# EAGLE design firefly (EAGLE 5.11)
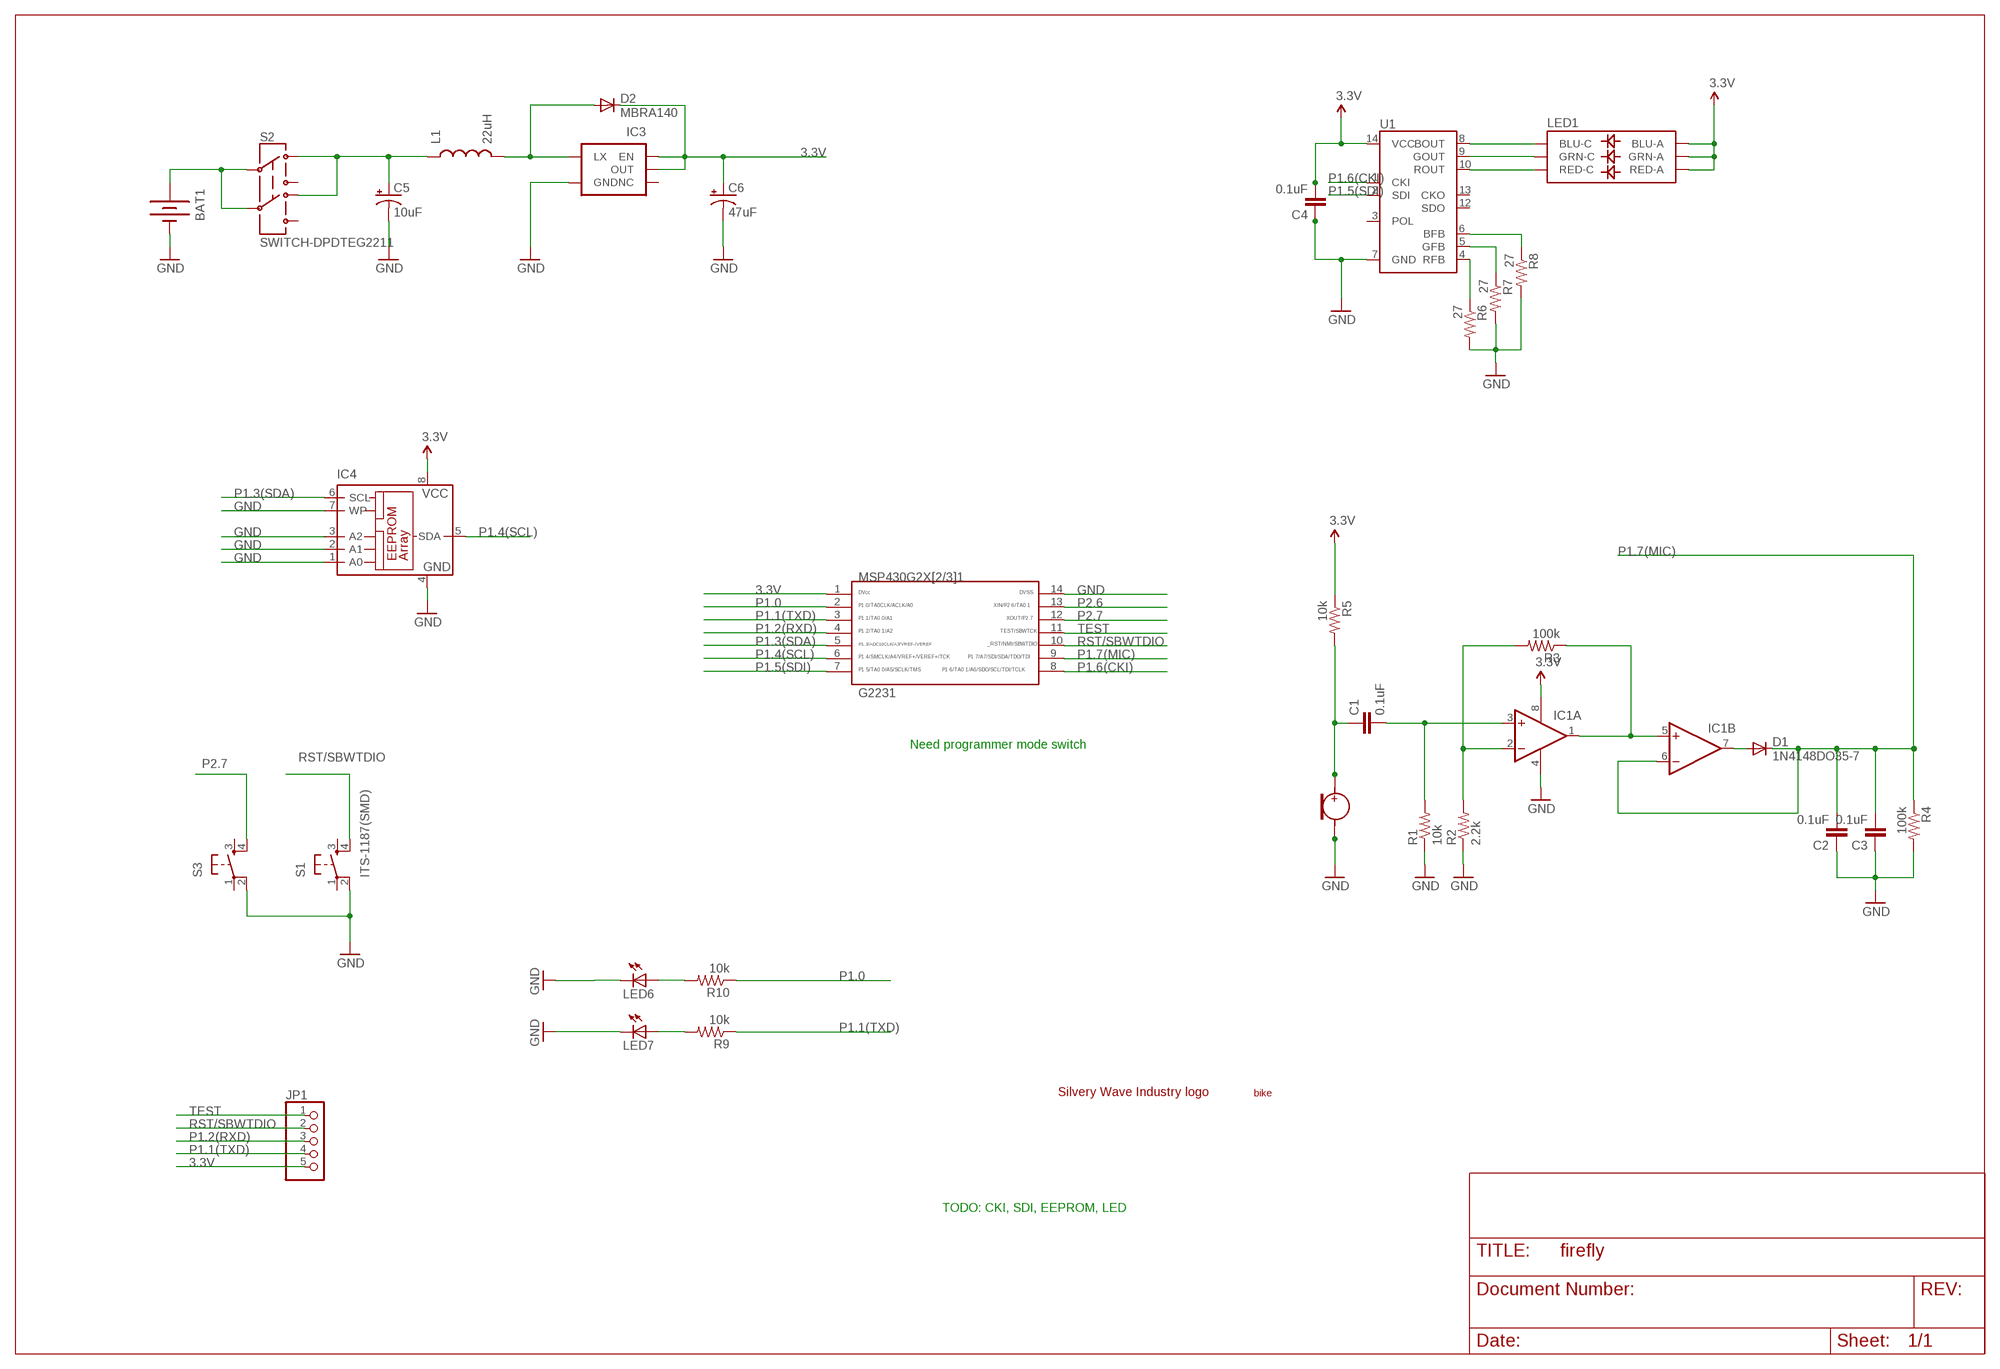
[diagram p0: schematic, sheet 1]

## Parts
BAT1  BATTERYAA  [BATTERY-AA]
C1  0.1uF  C-EUC2012  [C2012]
C2  0.1uF  C-EUC2012  [C2012]
C3  0.1uF  C-EUC2012  [C2012]
C4  0.1uF  C-EUC2012  [C2012]
C5  10uF  CAP_POL1206  [EIA3216]
C6  47uF  CAP_POL3528  [EIA3528]
D1  1N4148DO35-7  DIODESMA  [SMA-DIODE]
D2  MBRA140  DIODESMA  [SMA-DIODE]
G2231  G2X[2/3]1---PW14  [PW14]
IC1  LM358D  [SO08]
IC3  V_REG_NCP1400SOT23-5  [SOT23-5]
IC4  24LC256P  [DIL8]
JP1  PINHD-1X5  [1X05]
L1  22uH  INDUCTORCR54  [CR54]
LED1  LED-TRICOLOR-5050  [LED-TRICOLOR-5050]
LED6  LED1206  [LED-1206]
LED7  LED1206  [LED-1206]
R1  10k  R-US_M2012  [M2012]
R2  2.2k  R-US_M2012  [M2012]
R3  100k  R-US_M2012  [M2012]
R4  100k  R-US_M2012  [M2012]
R5  10k  R-US_M2012  [M2012]
R6  27  R-US_M2012  [M2012]
R7  27  R-US_M2012  [M2012]
R8  27  R-US_M2012  [M2012]
R9  10k  R-US_M2012  [M2012]
R10  10k  R-US_M2012  [M2012]
S1  ITS-1187(SMD)  TAC_SWITCHPTH  [TACTILE-PTH]
S2  SWITCH-DPDTEG2211  [EG2211]
S3  TAC_SWITCHPTH  [TACTILE-PTH]
U1  WS2801  [SOP-14]
U2  MIC  [MIC9.7MM]
U$1  SILVERYWAVE  [SILVERYWAVE]
U$2  BIKE  [BIKE]

## Nets
3.3V [3.3]: C4.2 C6.A(+) D2.C G2231.1 IC1.8(P:V+) IC3.1(EN) IC3.2(OUT) IC4.8(VCC) JP1.5 LED1.1(GRN-A) LED1.2(RED-A) LED1.3(BLU-A) R5.1 U1.14(VCC)
GND [Ground]: BAT1.GND@1(-) C2.1 C3.1 C4.1 C5.C(-) C6.C(-) G2231.14 IC1.4(P:V-) IC3.4(GND) IC4.1(A0) IC4.2(A1) IC4.3(A2) IC4.4(GND) IC4.7(WP) LED6.C LED7.C R1.1 R2.1 R4.2 R6.2 R7.2 R8.2 S1.2 S3.2 U1.7(GND) U2.GND(-)
N$1: C1.2 IC1.3(A:+IN) R1.2
N$2: IC1.2(A:-IN) R2.2 R3.2
N$3: LED1.4(BLU-C) U1.8(BOUT)
N$4: IC1.1(A:OUT) IC1.5(B:+IN) R3.1
N$5: D1.A IC1.7(B:OUT)
N$6: LED1.6(GRN-C) U1.9(GOUT)
N$7: LED1.5(RED-C) U1.10(ROUT)
N$8: R6.1 U1.4(RFB)
N$10: C1.1 R5.2 U2.PLUS(+)
N$11: R7.1 U1.5(GFB)
N$12: R8.1 U1.6(BFB)
N$13: D2.A IC3.5(LX) L1.P$2
N$14: LED7.A R9.2
N$16 [3.3]: BAT1.PWR@1(+) S2.P1 S2.P2
N$17: C5.A(+) L1.P$1 S2.P1-TA S2.P2-TA
N$34: LED6.A R10.2
P1.0: G2231.2 R10.1
P1.1(TXD): G2231.3 JP1.4 R9.1
P1.2(RXD): G2231.4 JP1.3
P1.3(SDA): G2231.5 IC4.6(SCL)
P1.4(SCL): G2231.6 IC4.5(SDA)
P1.5(SDI): G2231.7 U1.2(SDI)
P1.6(CKI): G2231.8 U1.1(CKI)
P1.7(MIC): C2.2 C3.2 D1.C G2231.9 IC1.6(B:-IN) R4.1
P2.6: G2231.13
P2.7: G2231.12 S3.4
RST/SBWTDIO: G2231.10 JP1.2 S1.4
TEST: G2231.11 JP1.1
Unconnected: IC3.3(NC) S1.1 S1.3 S2.P1-TB S2.P2-TB S3.1 S3.3 U1.3(POL) U1.12(SDO) U1.13(CKO)

## Notes on the sheet
- Need programmer mode switch
- TODO: CKI, SDI, EEPROM, LED

## Library data of the parts
BAT1 = SparkFun:BATTERY: Battery Holders Various common sizes : AA, AAA, 20mm coin cell and 12mm coin cell.
C1-C4 = resistor:C-EU: CAPACITOR, European symbol
C5 C6 = SparkFun:CAP_POL: Capacitor Polarized These are standard SMD and PTH capacitors. Normally 10uF, 47uF, and 100uF in electrolytic and tantalum varieties. Always verify the external diameter of the through hole cap, it varies with capacity, voltage, and manufacturer. The EIA devices should be standard.
D1 D2 = SparkFun:DIODE: Diode These are standard reverse protection diodes and small signal diodes. SMA package can handle up to about 1A. SOD-323 can handle about 200mA. What the SOD-323 package when ordering, there are some mfgs out there that are 5-pin packages.
G2231 = TI_MSP430_v16:G2X[2/3]1---PW14: MSP430G2X[2/3]1 TSSOP (PW) 14 Pin Package http://focus.ti.com/docs/prod/folders/print/msp430g2221.html MSP430G2121, MSP430G2221, MSP430G2131
IC1 = linear:LM358: OP AMP also LM158; LM258; LM2904 Source: http://cache.national.com/ds/LM/LM158.pdf
IC3 = SparkFun:V_REG_NCP1400: Switching step-up voltage regulator NCP1400 switiching regulator takes single cell AA and outputs 100mA at 3.3V or 5V with minimal number of external components.
IC4 = microchip:24*: Serial EEPROM I2C; MF: MICROCHIP; MPN: 24LC256-E/P; OC_FARNELL: 9757970; OC_NEWARK: 92C7169
JP1 = pinhead:PINHD-1X5: PIN HEADER
L1 = SparkFun:INDUCTOR: Inductors Basic Inductor/Choke - 0603 and 1206. Footprints are not proven and vary greatly between part numbers.
LED1 = SparkFun:LED-TRICOLOR-5050
LED6 LED7 = SparkFun:LED: LEDs Standard schematic elements and footprints for 5mm, 3mm, 1206, and 0603 sized LEDs. 5mm - Spark Fun Electronics SKU : COM-00529 (and others)
R1-R10 = resistor:R-US_: RESISTOR, American symbol
S1 S3 = SparkFun:TAC_SWITCH: Momentary Switch Button commonly used for reset or general input. Spark Fun Electronics SKU : COM-00097
S2 = SparkFun:SWITCH-DPDT: DPDT Version of the COM-00597
U1 = SparkFun:WS2801: WS2801 3 Channel Constant Current LED Driver with programmable PWM outputs. Datasheet: http://www.sparkfun.com/datasheets/Components/LED/WS2801.pdf
U2 = fetm:MIC
U$1 = silverywaveindustry:SILVERYWAVE
U$2 = donghee:BIKE

## Net classes
0 default: width 0.254 mm
1 Ground: width 0.5 mm, drill 0.2 mm
2 3.3: width 0.5 mm, drill 0.2 mm

## Board
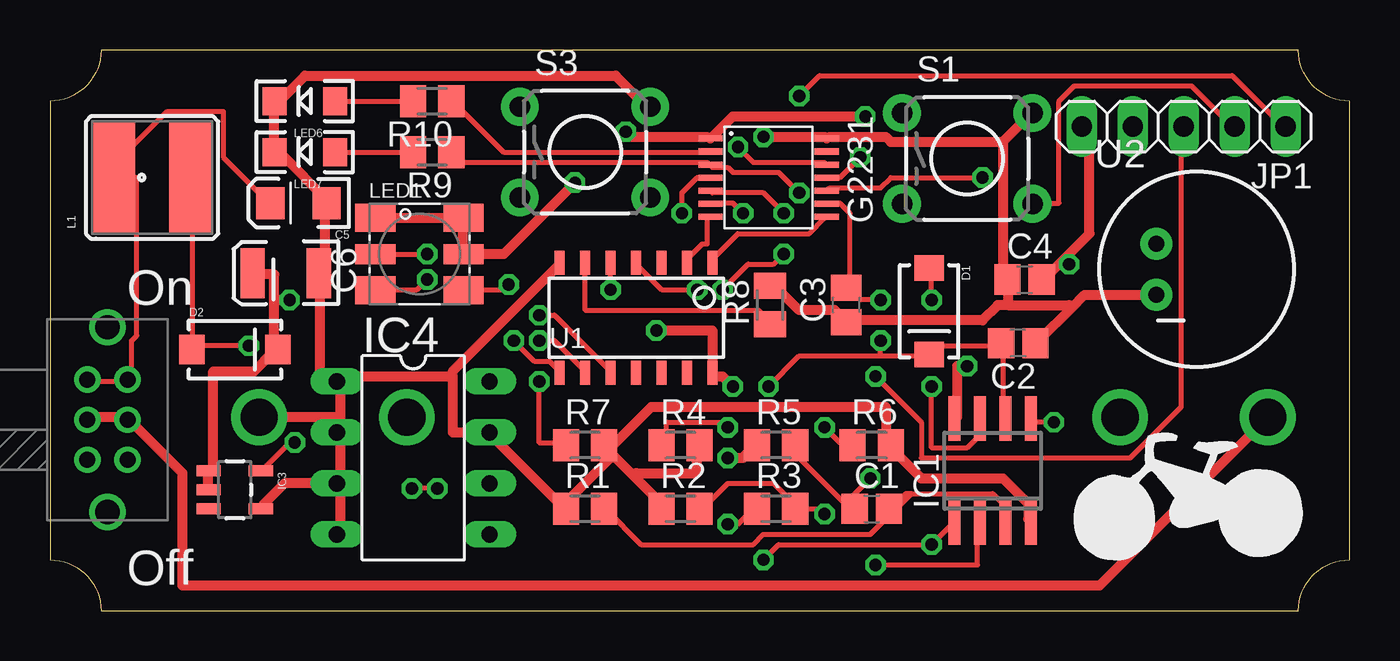
[diagram p1: board, top side]
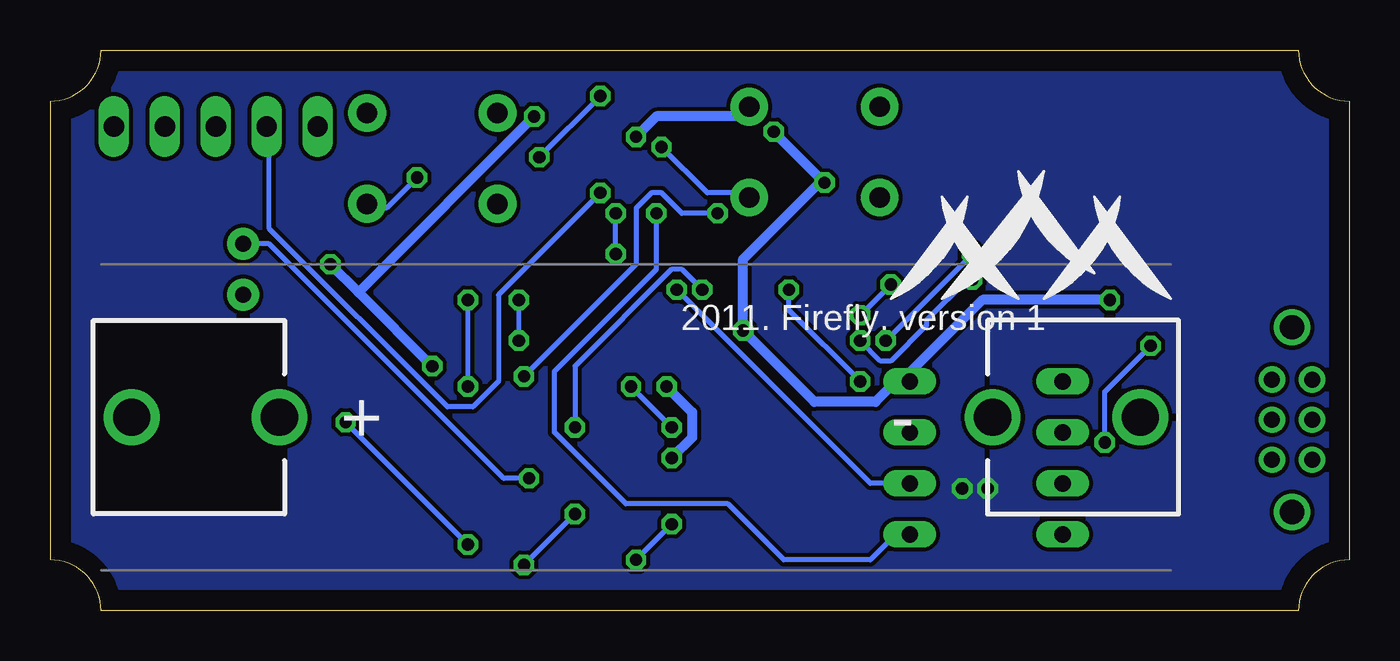
[diagram p2: board, bottom side, seen from below]

Size 64.77 x 27.94 mm. Coordinates in mm from the lower left corner, seen from the top.
Outline: 62.23,27.94 2.54,27.94 arc-90 0,25.4 0,2.54 arc-90 2.54,0 62.23,0 arc-90 64.77,2.54 64.77,25.4 arc-90 62.23,27.94
Copper layers (1*16): Top 0.035mm / dielectric 1.5mm / Bottom 0.035mm
Design rules "default": minimum track width 10mil, minimum drill 24mil, track to track 8mil, track to pad 8mil, pad to pad 8mil, via to via 8mil, smd to smd 8mil, copper to edge 40mil, drill to drill 8mil, minimum pad ring 10mil, minimum via ring 8mil, stop-mask expansion 4mil, vias tented up to drill 0mil, thermal gap 10mil

### Footprints (pad centres in the part's own frame; a part is rotated, then mirrored left to right if it is on the bottom)
BATTERY-AA = drill 1.854 round: GND@1 25.146,0; GND@2 17.78,0; PWR@1 -25.146,0; PWR@2 -17.78,0
C2012 = smd 1.3 x 1.5: 1 -0.85,0; 2 0.85,0
EIA3216 = smd 1.4 x 1.6: A 1.4,0; C -1.4,0
EIA3528 = smd 1.2 x 2.5: A 1.65,0; C -1.65,0
SMA-DIODE = smd 1.27 x 1.47: A -2.15,0; C 2.15,0
PW14 = smd 0.3 x 1.2: 1 -1.95,-2.9; 2 -1.3,-2.9; 3 -0.65,-2.9; 4 0,-2.9; 5 0.65,-2.9; 6 1.3,-2.9; 7 1.95,-2.9; 8 1.95,2.9; 9 1.3,2.9; 10 0.65,2.9; 11 0,2.9; 12 -0.65,2.9; 13 -1.3,2.9; 14 -1.95,2.9
SO08 = smd 0.6 x 2.2: 1 -1.905,-2.6; 2 -0.635,-2.6; 3 0.635,-2.6; 4 1.905,-2.6; 5 1.905,2.6; 6 0.635,2.6; 7 -0.635,2.6; 8 -1.905,2.6
SOT23-5 = smd 0.55 x 1.2: 1 -0.95,-1.3; 2 0,-1.3; 3 0.95,-1.3; 4 0.95,1.3; 5 -0.95,1.3
DIL8 = drill 0.813 long: 1 -3.81,-3.81; 2 -1.27,-3.81; 3 1.27,-3.81; 4 3.81,-3.81; 5 3.81,3.81; 6 1.27,3.81; 7 -1.27,3.81; 8 -3.81,3.81
1X05 = drill 1.016 long: 1 -5.08,0; 2 -2.54,0; 3 0,0; 4 2.54,0; 5 5.08,0
CR54 = smd 5.5 x 2.15: P$1 0,1.92; P$2 0,-1.92
LED-TRICOLOR-5050 = smd 2 x 1.4: 1 2.2,1.8; 2 -2.2,1.8; 5 2.2,-1.8; 6 -2.2,-1.8 | smd 2 x 1: 3 2.2,0; 4 -2.2,0
LED-1206 = smd 1.2 x 1.4: A -1.5,0; C 1.5,0
M2012 = smd 1.3 x 1.6: 1 -0.95,0; 2 0.95,0
TACTILE-PTH = drill 1.016 pad 1.88 round: 1 -3.251,2.261; 2 3.251,2.261; 3 -3.251,-2.261; 4 3.251,-2.261
EG2211 = drill 0.8 round: P1 -1,0; P1-TA -1,2; P1-TB -1,-2; P2 1,0; P2-TA 1,2; P2-TB 1,-2 | drill 1.2 round: P$7 0,4.6; P$8 0,-4.6
SOP-14 = smd 0.5 x 1.2: 1 -3.81,-2.75; 2 -2.54,-2.75; 3 -1.27,-2.75; 4 0,-2.75; 5 1.27,-2.75; 6 2.54,-2.75; 7 3.81,-2.75; 8 3.81,2.75; 9 2.54,2.75; 10 1.27,2.75; 11 0,2.75; 12 -1.27,2.75; 13 -2.54,2.75; 14 -3.81,2.75
MIC9.7MM = drill 0.8 pad 1.6 round: GND -2,-1.27; PLUS -2,1.27

### Placement (x,y rotation side)
BAT1  35.56,9.65 0 bottom
C1  40.96,5.08 0 top
C2  48.26,13.34 180 top
C3  39.69,15.24 90 top
C4  48.58,16.51 0 top
C5  12.38,20.32 180 top
C6  11.75,16.83 180 top
D1  43.81,14.92 270 top
D2  9.21,13.02 0 top
G2231  35.81,21.59 270 top
IC1  46.99,6.99 0 top
IC3  9.21,6.03 270 top
IC4  18.1,7.62 270 top
JP1  56.52,24.13 180 top
L1  5.08,21.59 90 top
LED1  18.41,17.78 0 top
LED6  12.7,25.4 180 top
LED7  12.7,22.86 180 top
R1  26.67,5.08 0 top
R2  31.43,5.08 0 top
R3  36.2,5.08 0 top
R4  31.43,8.26 0 top
R5  36.2,8.26 0 top
R6  40.96,8.26 0 top
R7  26.67,8.26 0 top
R8  35.88,15.24 90 top
R9  19.05,22.86 180 top
R10  19.05,25.4 180 top
S1  45.72,22.54 0 top
S2  2.86,9.53 0 top
S3  26.67,22.86 0 top
U1  29.21,14.61 180 top
U2  57.15,17.02 0 top
U$1  16.51,18.1 0 bottom
U$2  51.05,2.54 0 top

### Tracks (layer width: path | path; a pad name or v marks a point on that pad's centre or on a via)
3.3V  (via drill 0.61)
  Top 0.5: 50.42,17.4 51.82,18.8 51.82,24.13 JP1.5 | 50.42,17.4 49.53,16.51 C4.2 | v45.72,12.19 45.21,12.19 45.21,9.65 IC1.8 | v50.8,17.27 50.55,17.27 50.42,17.4 | IC3.2 7.87,6.1 7.87,6.86 IC3.1 8.13,7.11 8.13,11.94 10.16,11.94 11.18,12.95 D2.C 11.18,13.21 11.18,15.49 | 11.18,15.49 11.18,16.76 10.16,16.76 C6.A | LED1.2 16.26,19.56 20.57,19.56 LED1.1 20.57,19.3 20.57,17.78 LED1.3 22.61,17.78 v26.16,21.34 | v28.7,23.88 28.96,23.62 32.77,23.62 G2231.1 33.02,23.62 34.04,24.64 v40.64,24.64 | v30.23,13.97 33.02,13.97 U1.14 33.02,11.68 33.53,11.68 v34.04,11.18 | v33.78,7.62 34.54,7.62 35.05,8.13 R5.1 | 11.18,15.49 v11.94,15.49
  Bottom 0.5: 49.4,15.88 v50.8,17.27 | 49.4,15.88 v45.72,12.19 | v28.7,23.88 v26.16,21.34 26.42,21.34 30.23,17.53 v30.23,13.97 26.67,10.41 23.62,10.41 22.61,11.43 22.35,11.43 | v33.78,7.62 32.77,8.64 32.77,9.91 v34.04,11.18 | 22.35,11.43 IC4.8 22.1,11.43 | v11.94,15.49 18.29,15.49 22.35,11.43 | v40.64,24.64 49.4,15.88
GND  (via drill 0.61)
  Top 0.5: 47.5,23.37 41.91,23.37 41.66,23.62 38.86,23.62 G2231.14 38.61,23.62 v35.56,23.62 | 47.5,23.37 48.77,24.64 S1.2 | R8.2 36.07,16 36.32,16 37.34,14.99 39.12,14.99 39.62,14.48 C3.1 39.88,14.48 46.48,14.48 47.24,15.24 47.75,15.24 | 50.93,15.11 51.56,15.75 U2.GND | 50.93,15.11 49.28,13.46 C2.1 | 47.75,15.24 47.75,16.51 C4.1 47.5,16.51 47.5,23.37 | 47.75,15.24 50.8,15.24 50.93,15.11 | S3.2 29.72,25.15 28.19,26.67 12.7,26.67 11.43,25.4 LED6.C 11.18,25.4 11.18,22.86 LED7.C 11.43,22.86 13.97,20.32 C5.C 13.72,20.32 13.72,17.02 13.46,17.02 C6.C 13.46,16.76 13.46,11.68 14.48,11.68 IC4.1 14.48,11.43 | 14.48,9.65 14.48,11.43 | 14.48,8.89 14.48,9.65 | IC3.4 10.67,5.33 11.68,6.35 IC4.3 14.48,6.35 | 14.48,6.35 14.48,3.81 IC4.4 | 14.48,6.35 14.48,8.89 | 14.48,8.89 IC4.2 | 14.48,9.65 BAT1.GND@1 | IC1.4 48.77,4.57 48.77,5.33 47.5,6.6 43.43,6.6 41.91,8.13 R6.2 41.66,8.38 41.66,10.16 29.97,10.16 27.94,8.13 R7.2 | 29.08,6.73 30.73,5.08 R2.1 | 29.08,6.73 27.69,8.13 R7.2 | R4.2 32.26,8.13 32.26,6.86 29.21,6.86 29.08,6.73 | 20.07,11.68 20.07,8.89 21.84,8.89 | 20.07,11.68 20.07,11.94 25.4,17.27 U1.7 | 21.84,8.89 25.65,5.08 R1.1 25.65,5.33 27.94,7.62 R7.2 | 21.84,8.89 IC4.7 | 14.48,11.43 14.73,11.68 20.07,11.68
  Bottom 0.5: v35.56,23.62 34.54,24.64 30.23,24.64 29.97,24.89 S3.2
N$1
  Top 0.254: 42.93,5.84 46.99,5.84 47.5,5.33 47.5,4.57 IC1.3 | 42.93,5.84 42.67,5.84 41.91,5.08 C1.2 | 42.93,5.84 40.89,3.81 35.56,3.81 35.05,3.3 29.46,3.3 27.69,5.08 R1.2
N$2  (via drill 0.61)
  Top 0.254: 37.34,5.08 36.07,6.35 33.78,6.35 32.51,5.08 R2.2 | v41.15,2.29 46.23,2.29 46.23,4.32 IC1.2 | v38.61,4.83 38.35,5.08 37.34,5.08 | 37.34,5.08 R3.2
  Bottom 0.254: v38.61,4.83 v41.15,2.29
N$3  (via drill 0.61)
  Top 0.254: v23.11,13.46 24.13,12.45 24.89,12.45 25.4,11.94 U1.8 | LED1.4 v18.8,17.78
  Bottom 0.254: v18.8,17.78 v23.11,13.46
N$4  (via drill 0.61)
  Top 0.254: v33.78,4.32 34.29,4.32 35.05,5.08 R3.1 | v35.56,2.54 36.32,3.3 v43.94,3.3 44.96,4.32 IC1.1 | v50.04,9.4 49.02,9.4 IC1.5
  Bottom 0.254: v33.78,4.32 v35.56,2.54 | v43.94,3.3 v50.04,9.4
N$5  (via drill 0.61)
  Top 0.254: v43.94,15.49 43.94,17.02 D1.A | v43.94,11.18 43.94,8.13 45.72,8.13 46.23,8.64 46.23,9.4 IC1.7
  Bottom 0.254: v43.94,11.18 v43.94,15.49
N$6  (via drill 0.61)
  Top 0.254: v24.38,13.46 25.15,13.46 26.67,11.94 U1.9 | v18.8,16.51 18.29,16 16.26,16 LED1.6
  Bottom 0.254: v24.38,13.46 23.37,12.45 22.86,12.45 21.08,14.22 21.08,14.48 19.05,16.51 v18.8,16.51
N$7  (via drill 0.61)
  Top 0.254: v24.38,14.73 25.15,14.73 27.94,11.94 U1.10 | v22.86,16.26 22.61,16 20.83,16 LED1.5
  Bottom 0.254: v22.86,16.26 v24.38,14.73
N$8  (via drill 0.61)
  Top 0.254: v32.26,16 30.48,16 29.21,17.27 U1.4 | v38.61,9.14 39.37,8.38 39.88,8.38 R6.1
  Bottom 0.254: v32.26,16 33.27,17.02 33.78,17.02 38.61,12.19 v38.61,9.14
N$10  (via drill 0.61)
  Top 0.254: 39.62,5.33 37.34,7.62 37.34,8.13 R5.2 | 39.62,5.33 39.88,5.08 C1.1 39.62,5.33 | 39.62,5.33 v40.89,6.6
  Bottom 0.254: v40.89,6.6 42.16,6.6 53.85,18.29 U2.PLUS
N$11  (via drill 0.61)
  Top 0.254: v24.38,11.43 24.38,8.38 25.65,8.38 R7.1 | v27.94,16 U1.5
  Bottom 0.254: v27.94,16 27.94,14.99 v24.38,11.43
N$12
  Top 0.254: U1.6 26.67,14.99 35.31,14.99 35.81,14.48 R8.1
N$13  (via drill 0.61)
  Top 0.254: v12.19,8.38 11.94,8.38 10.67,7.11 IC3.5 | v9.91,13.21 7.11,13.21 | 7.11,13.21 7.11,21.59 L1.P$2 | 7.11,13.21 D2.A
  Bottom 0.254: v12.19,8.38 12.19,10.92 v9.91,13.21
N$14
  Top 0.254: LED7.A R9.2
N$15  (via drill 0.61)
  Top 0.254: v19.3,6.1 v18.03,6.1
  pour Bottom: 2.83,-0.08 0.29,2.46 0.29,25.32 2.83,27.86 61.77,27.86 64.31,25.32 64.31,2.46 61.77,-0.08
N$16
  Top 0.5: S2.P1 2.03,9.65 3.81,9.65 S2.P2 4.06,9.4 6.6,6.86 6.6,1.27 52.32,1.27 BAT1.PWR@1
N$17
  Top 0.254: S2.P1-TA 2.03,11.43 3.81,11.43 S2.P2-TA 4.06,11.68 4.06,13.46 4.32,13.72 4.32,21.59 3.3,21.59 | 3.3,21.59 3.3,22.35 5.84,24.89 8.64,24.89 8.64,22.61 10.92,20.32 C5.A | 3.3,21.59 L1.P$1
N$34
  Top 0.254: LED6.A R10.2
P1.0
  Top 0.254: G2231.2 32.77,22.86 22.61,22.86 20.07,25.4 R10.1
P1.1(TXD)  (via drill 0.61)
  Top 0.254: R9.1 20.07,22.86 20.57,22.35 32.77,22.35 G2231.3 33.02,22.1 33.78,22.1 34.04,21.84 36.32,21.84 v37.34,20.83
  Bottom 0.254: v37.34,20.83 42.42,15.75 42.42,11.43 43.69,10.16 44.96,10.16 53.85,19.05 53.85,24.13 JP1.4
P1.2(RXD)  (via drill 0.61)
  Top 0.254: v31.5,19.81 31.5,20.83 32.26,21.59 G2231.4 | v41.15,11.68 43.43,9.4 43.43,7.62 53.85,7.62 56.39,10.16 56.39,24.13 JP1.3
  Bottom 0.254: v31.5,19.81 33.27,19.81 34.29,20.83 34.8,20.83 35.56,20.07 35.56,17.27 v41.15,11.68
P1.3(SDA)  (via drill 0.61)
  Top 0.254: v36.58,19.81 35.56,20.83 33.02,20.83 G2231.5 | v36.58,17.78 36.07,17.27 34.8,17.27 v33.53,16
  Bottom 0.254: v36.58,17.78 v36.58,19.81 | v33.53,16 23.88,6.35 IC4.6
P1.4(SCL)  (via drill 0.61)
  Top 0.254: v34.54,19.81 34.04,20.32 33.02,20.32 G2231.6
  Bottom 0.254: v34.54,19.81 34.54,17.02 39.62,11.94 39.62,8.89 36.07,5.33 30.99,5.33 28.19,2.54 23.88,2.54 22.61,3.81 IC4.5
P1.5(SDI)
  Top 0.254: G2231.7 32.77,19.56 32.77,18.29 32.51,18.29 31.75,17.53 U1.2
P1.6(CKI)
  Top 0.254: G2231.8 38.61,19.56 37.85,18.8 34.29,18.8 33.02,17.53 U1.1
P1.7(MIC)  (via drill 0.61)
  Top 0.254: G2231.9 38.86,20.32 39.37,20.32 39.88,19.81 39.88,16.26 C3.2 39.88,16 40.39,15.49 v41.4,15.49 | v33.78,9.14 33.53,9.4 30.73,9.4 30.73,8.38 R4.1 | v35.81,11.18 37.34,12.7 41.4,12.7 | 41.4,12.7 43.69,12.7 D1.C 43.94,12.95 44.2,13.21 47.24,13.21 C2.2 47.5,13.21 47.5,9.65 IC1.6 | 41.4,12.7 v41.4,13.46
  Bottom 0.254: v33.78,9.14 v35.81,11.18 | v41.4,13.46 v41.4,15.49
P2.7  (via drill 0.61)
  Top 0.254: v34.29,23.11 35.05,22.35 38.61,22.35 G2231.12
  Bottom 0.254: v34.29,23.11 32,20.83 29.97,20.83 S3.4
RST/SBWTDIO  (via drill 0.61)
  Top 0.254: v46.48,21.59 41.91,21.59 41.4,21.08 38.86,21.08 G2231.10 | JP1.2 58.93,24.13 56.9,26.16 51.05,26.16 50.29,25.4 50.29,20.32 49.02,20.32 S1.4
  Bottom 0.254: v46.48,21.59 48.01,20.07 48.77,20.07 S1.4
TEST  (via drill 0.61)
  Top 0.254: v40.39,22.61 39.37,21.59 G2231.11 | v37.34,25.65 38.35,26.67 58.93,26.67 61.47,24.13 JP1.1
  Bottom 0.254: v40.39,22.61 v37.34,25.65

### Text on the board
tPlace: On | Off
bPlace: 2011. Firefly. version 1